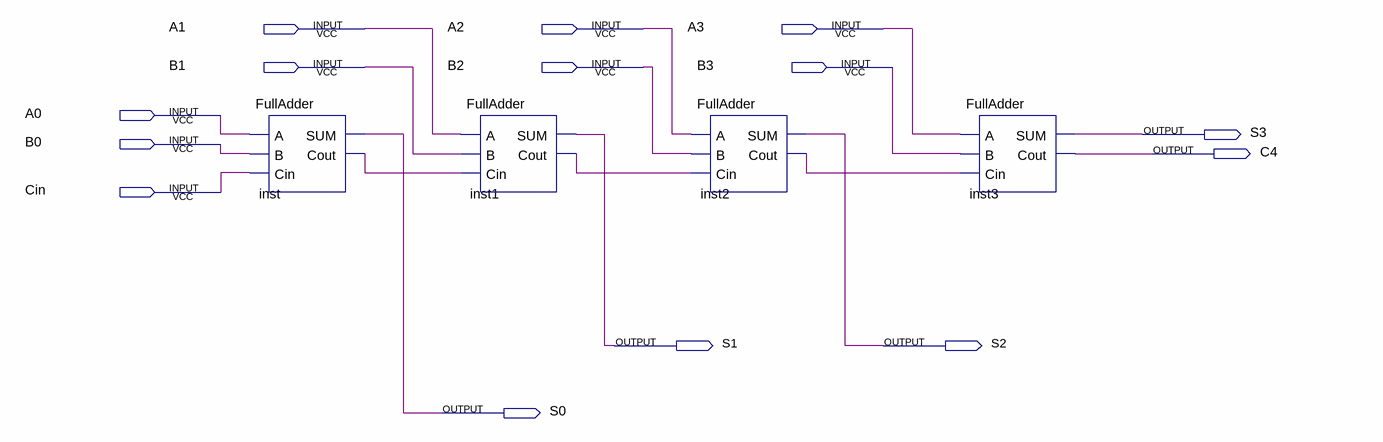
[diagram p0: schematic sheet]
// Quartus schematic 4bitAdder.bdf as structural Verilog: 4 symbols, 14 pins
module \4bitAdder  (
  input  A1,
  input  A2,
  input  A3,
  input  B1,
  input  B2,
  input  B3,
  input  A0,
  input  B0,
  input  Cin,
  output S3,
  output C4,
  output S1,
  output S2,
  output S0
);

  wire inst1_cout, inst2_cout, inst_cout;

  FullAdder inst (.A(A0), .B(B0), .Cin(Cin), .SUM(S0), .Cout(inst_cout));
  FullAdder inst1 (.A(A1), .B(B1), .Cin(inst_cout), .SUM(S1), .Cout(inst1_cout));
  FullAdder inst2 (.A(A2), .B(B2), .Cin(inst1_cout), .SUM(S2), .Cout(inst2_cout));
  FullAdder inst3 (.A(A3), .B(B3), .Cin(inst2_cout), .SUM(S3), .Cout(C4));
endmodule
